# Altium schematic sheet BMS_LOST_V2.SchDoc
size A4
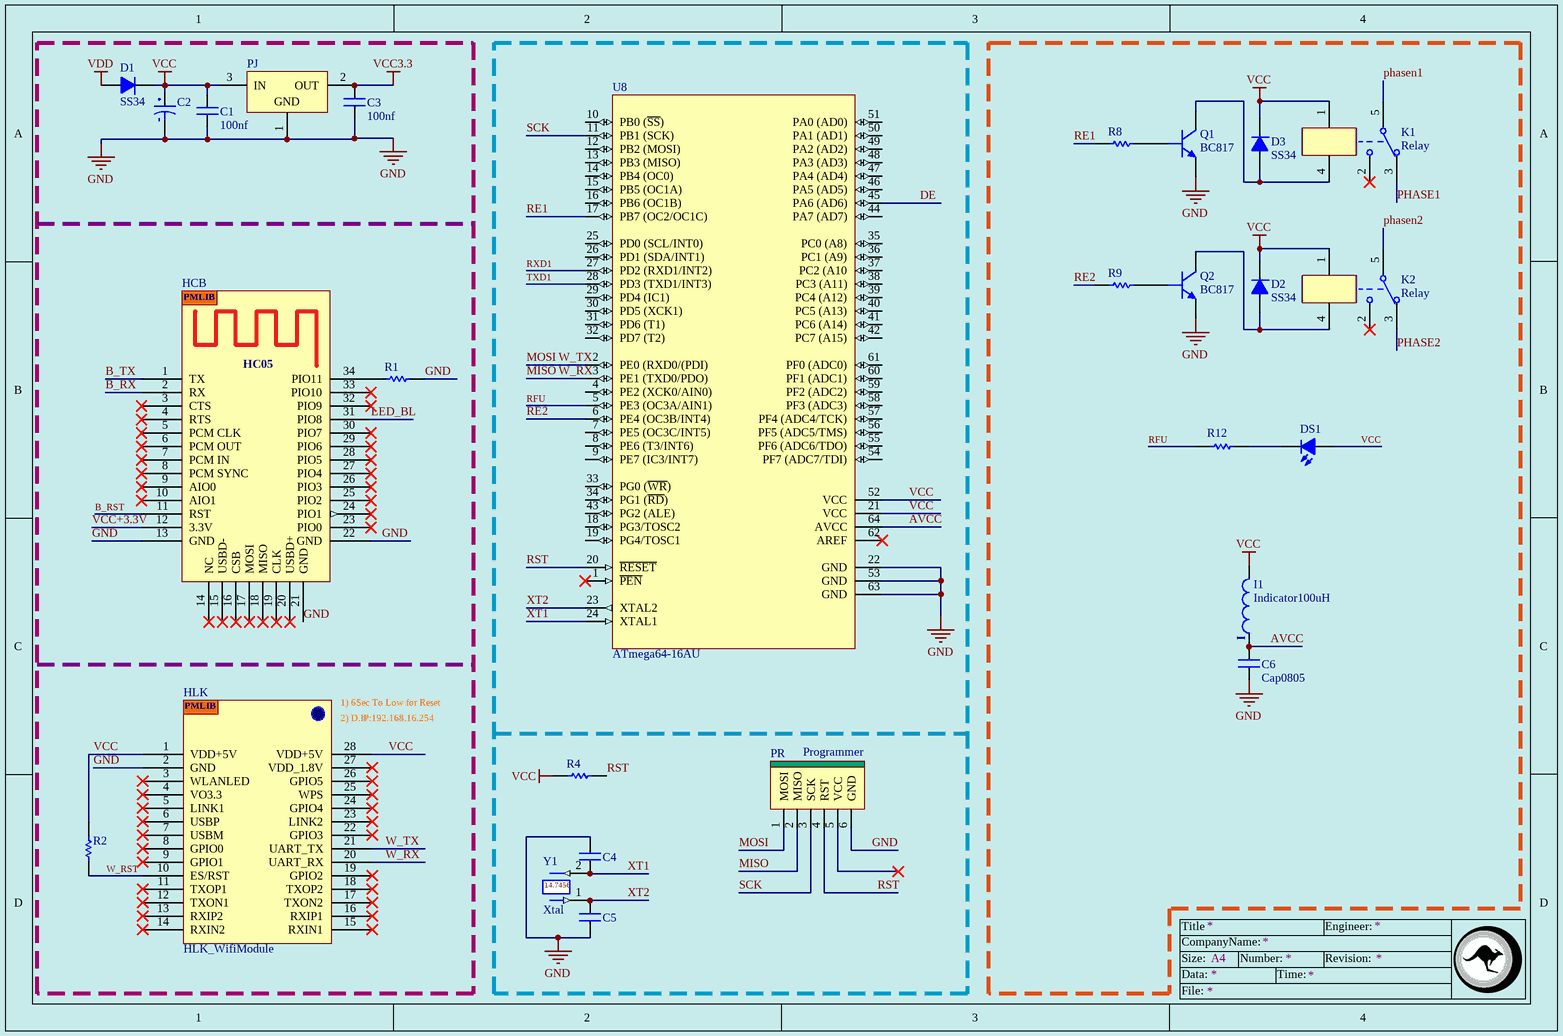
[diagram p0: BMS_LOST_V2.SchDoc]

## Parts
C1  100nf  [Cap0805]
C2  Cap_4mm  [2220]  (value not drawn)
C3  100nf  [Cap0805]
C4  CAP 805  [Cap0805]  (value not drawn)
C5  CAP 805  [Cap0805]  (value not drawn)
C6  Cap0805  [Cap0805]
D1  SS34  [Diod-1A-SMD]
D2  SS34  [Diod-1A-SMD]
D3  SS34  [Diod-1A-SMD]
DS1  LED1  [LED3MM]  (value not drawn)
HC  HC05_Bluetooth  [HC05_Bluetooth]  (value not drawn)  (part B of 2)
HLK  HLK_WifiModule  [HLK]
I1  Indicator100uH  [Indicator0805]
K1  Relay  [RelayMilionMiniS-Z]
K2  Relay  [RelayMilionMiniS-Z]
PJ  PJ1117_3.3V  [PJ1117s]  (value not drawn)
PR  Programmer  [Programmer]
Q1  BC817  [SOT23]
Q2  BC817  [SOT23]
R1  Res 0805  [R0805]  (value not drawn)
R2  Res 0805  [R0805]  (value not drawn)
R4  Res 0805  [R0805]  (value not drawn)
R8  Res 0805  [R0805]  (value not drawn)
R9  Res 0805  [R0805]  (value not drawn)
R12  330  [R0805]  (value not drawn)
U8  ATmega64-16AU  [64A_L]
Y1  Xtal  [CrystallB]

## Nets
GND: C1.2 C2.1 C3.2 C4.2 C5.2 C6.1 HC.13(GND) HC.21(GND) HC.22(GND) HLK.2(GND) PJ.1(GND) PR.6(GND) Q1.2(E) Q2.2(E) R1.1 U8.22(GND) U8.53(GND) U8.63(GND)
VCC: C1.1 C2.2 D1.K D2.K D3.K DS1.A HLK.1(VDD+5V) HLK.28(VDD+5V) I1.2 K1.1 K2.1 PJ.3(IN) R2.1 R4.2 U8.21(VCC) U8.52(VCC)
VCC3.3: C3.1 PJ.2(OUT)
VDD: D1.A
AVCC: C6.2 I1.1 U8.64(AVCC)
B_RST: HC.11(RST)
B_RX: HC.2(RX)
B_TX: HC.1(TX)
DE: U8.45(PA6_(AD6))
LED_BL: HC.31(PIO8)
MISO: HLK.20(UART_RX) PR.2(MISO) U8.3(PE1_(TXD0/PDO))  [also labelled W_RX]
MOSI: HLK.21(UART_TX) PR.1(MOSI) U8.2(PE0_(RXD0/(PDI))  [also labelled W_TX]
PHASE1: K1.3
PHASE2: K2.3
phasen1: K1.5
phasen2: K2.5
RE1: R8.2 U8.17(PB7_(OC2/OC1C))
RE2: R9.2 U8.6(PE4_(OC3B/INT4))
RFU: R12.2 U8.5(PE3_(OC3A/AIN1))
RST: PR.4(RST) R4.1 U8.20(~{RESET})
RXD1: U8.27(PD2_(RXD1/INT2))
SCK: PR.3(SCK) U8.11(PB1_(SCK))
TXD1: U8.28(PD3_(TXD1/INT3))
VCC+3.3V: HC.12(3.3V)
W_RST: HLK.10(ES/RST) R2.2
XT1: C4.1 U8.24(XTAL1) Y1.2
XT2: C5.1 U8.23(XTAL2) Y1.1
NetD2_A: D2.A K2.4 Q2.3(C)
NetD3_A: D3.A K1.4 Q1.3(C)
NetDS1_K: DS1.K R12.1
NetHC_34: HC.34(PIO11) R1.2
NetQ1_1: Q1.1(B) R8.1
NetQ2_1: Q2.1(B) R9.1

Not connected (* = marked no-connect by the designer): HC 3(CTS)* 4(RTS)* 5(PCM_CLK)* 6(PCM_OUT)* 7(PCM_IN)* 8(PCM_SYNC)* 9(AIO0)* 10(AIO1)* 14(NC)* 15(USBD-)* 16(CSB)* 17(MOSI)* 18(MISO)* 19(CLK)* 20(USBD+)* 23(PIO0)* 24(PIO1)* 25(PIO2)* 26(PIO3)* 27(PIO4)* 28(PIO5)* 29(PIO6)* 30(PIO7)* 32(PIO9)* 33(PIO10)*; HLK 3(WLANLED)* 4(VO3.3)* 5(LINK1)* 6(USBP)* 7(USBM)* 8(GPIO0)* 9(GPIO1)* 11(TXOP1)* 12(TXON1)* 13(RXIP2)* 14(RXIN2)* 15(RXIN1)* 16(RXIP1)* 17(TXON2)* 18(TXOP2)* 19(GPIO2)* 22(GPIO3)* 23(LINK2)* 24(GPIO4)* 25(WPS)* 26(GPIO5)* 27(VDD_1.8V)*; K1 2*; K2 2*; PR 5(VCC)*; U8 1(~{PEN})* 4(PE2_(XCK0/AIN0)) 7(PE5_(OC3C/INT5)) 8(PE6_(T3/INT6)) 9(PE7_(IC3/INT7)) 10(PB0_(~{SS})) 12(PB2_(MOSI)) 13(PB3_(MISO)) 14(PB4_(OC0)) 15(PB5_(OC1A)) 16(PB6_(OC1B)) 18(PG3/TOSC2) 19(PG4/TOSC1) 25(PD0_(SCL/INT0)) 26(PD1_(SDA/INT1)) 29(PD4_(IC1)) 30(PD5_(XCK1)) 31(PD6_(T1)) 32(PD7_(T2)) 33(PG0_(~{WR})) 34(PG1_(~{RD})) 35(PC0_(A8)) 36(PC1_(A9)) 37(PC2_(A10) 38(PC3_(A11)) 39(PC4_(A12)) 40(PC5_(A13)) 41(PC6_(A14)) 42(PC7_(A15)) 43(PG2_(ALE)) 44(PA7_(AD7)) 46(PA5_(AD5)) 47(PA4_(AD4)) 48(PA3_(AD3)) 49(PA2_(AD2)) 50(PA1_(AD1)) 51(PA0_(AD0)) 54(PF7_(ADC7/TDI)) 55(PF6_(ADC6/TDO)) 56(PF5_(ADC5/TMS)) 57(PF4_(ADC4/TCK)) 58(PF3_(ADC3)) 59(PF2_(ADC2)) 60(PF1_(ADC1)) 61(PF0_(ADC0)) 62(AREF)*

## Notes on the sheet
- (near HLK) 1) 6Sec To Low for Reset
- (near HLK) 2) D.IP:192.168.16.254
- Title
- Size:
- Data:
- CompanyName:
- A4
- Number:
- Time:
- Revision:
- Engineer:
- File:
- (in symbol Crystal) 14.7456
- (in symbol HC05_Bluetooth, part B) PMLIB; HC05
- (in symbol HLK_WifiModule) PMLIB
- (in symbol Indicator100uH) I

## Library data of the parts
C1 C3-C6 = Cap0805: surface mount capacitor (size 805)
C2 = Cap_Pola
D1-D3 = Diode
K1 K2 = RelayMilon
Q1 Q2 = Transistor NPN
R12 = Res 0805
U8 = ATmega64-16AU: 8-bit AVR Microcontroller, 4.5-5.5V, 64KB Flash, 2KB EEPROM, 4KB SRAM, 64-pin TQFP, Industrial Grade (-40°C to 85°C), Pb-Free; DatasheetVersion: revQ, Jul-2010; PackageVersion: revC, Oct-2010; PackageReference: 64A; PackageDescription: 64-Pin Plastic Thin Profile Quad Flat Pack, 14 x 14 x 1.0 mm Body, 0.8 mm Pitch (TQFP); Code_JEDEC: MS-026-AEB; ComponentLink1Description: Manufacturer URL; ComponentLink1URL: http://www.atmel.com/; ComponentLink2Description: ATmega64(L)  Datasheet; ComponentLink2URL: http://www.atmel.com/dyn/resources/prod_documents/doc2490.pdf; ComponentLink3Description: ATmega64(L) Summary; ComponentLink3URL: http://www.atmel.com/dyn/resources/prod_documents/2490S.pdf
Y1 = Crystal